# EAGLE design rev1_6 (EAGLE 7.6.0)
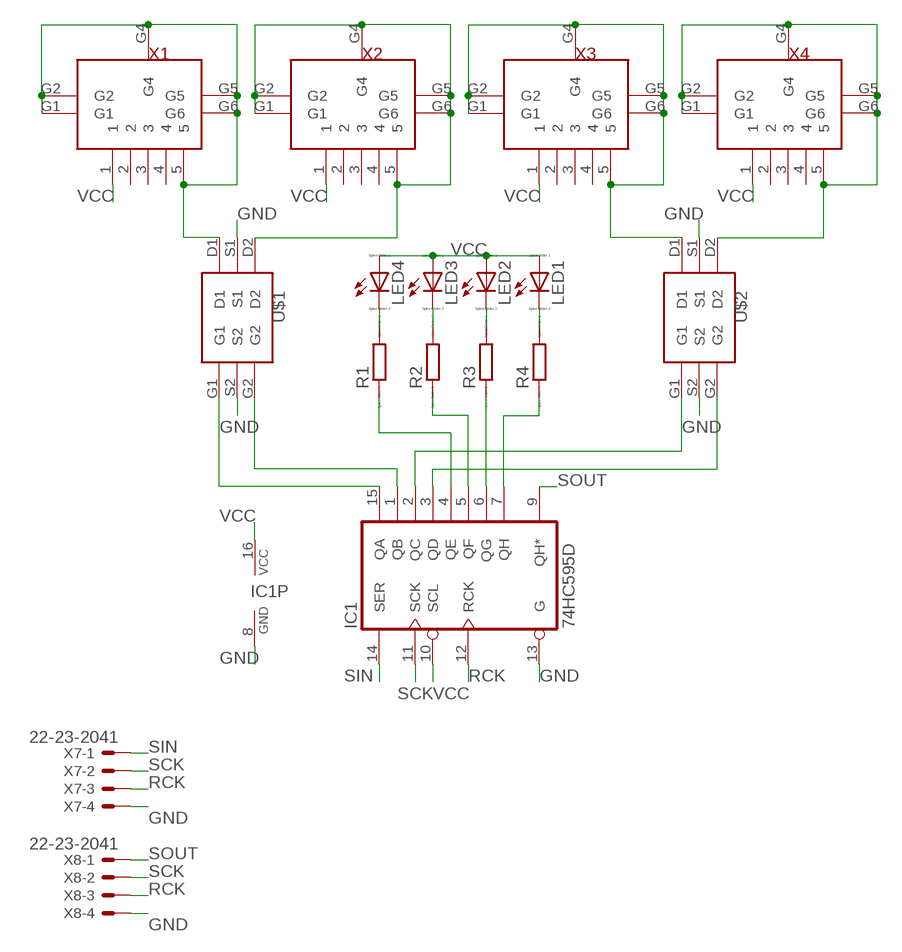
[diagram p0: schematic, sheet 1]

## Parts
IC1  74HC595D  [SO16]
LED1  LED_E  [LED_1206]
LED2  LED_E  [LED_1206]
LED3  LED_E  [LED_1206]
LED4  LED_E  [LED_1206]
R1  RR1005  [R1005]
R2  RR1005  [R1005]
R3  RR1005  [R1005]
R4  RR1005  [R1005]
U$1  FDC6305N  [FDC6305]
U$2  FDC6305N  [FDC6305]
X1  MUSBV  [MUSBV]
X2  MUSBV  [MUSBV]
X3  MUSBV  [MUSBV]
X4  MUSBV  [MUSBV]
X7  22-23-2041  [22-23-2041]
X8  22-23-2041  [22-23-2041]

## Nets
GND: IC1.8(GND) IC1.13(G) U$1.S1 U$1.S2 U$2.S1 U$2.S2 X7.4 X8.4
N$1: IC1.15(QA) U$1.G1
N$2: IC1.1(QB) U$1.G2
N$3: IC1.2(QC) U$2.G1
N$4: IC1.3(QD) U$2.G2
N$5: LED4.C R1.2
N$6: LED3.C R2.2
N$7: LED2.C R3.2
N$8: LED1.C R4.2
N$9: U$1.D1 X1.5 X1.G1 X1.G2 X1.G4 X1.G5 X1.G6
N$10: U$1.D2 X2.5 X2.G1 X2.G2 X2.G4 X2.G5 X2.G6
N$11: U$2.D1 X3.5 X3.G1 X3.G2 X3.G4 X3.G5 X3.G6
N$12: U$2.D2 X4.5 X4.G1 X4.G2 X4.G4 X4.G5 X4.G6
N$13: IC1.4(QE) R1.1
N$14: IC1.5(QF) R2.1
N$15: IC1.6(QG) R3.1
N$16: IC1.7(QH) R4.1
RCK: IC1.12(RCK) X7.3 X8.3
SCK: IC1.11(SCK) X7.2 X8.2
SIN: IC1.14(SER) X7.1
SOUT: IC1.9(QH*) X8.1
VCC: IC1.10(SCL) IC1.16(VCC) LED1.A LED2.A LED3.A LED4.A X1.1 X2.1 X3.1 X4.1
Unconnected: X1.2 X1.3 X1.4 X2.2 X2.3 X2.4 X3.2 X3.3 X3.4 X4.2 X4.3 X4.4

## Library data of the parts
IC1 = 74xx-eu:74*595: 8-bit SHIFT REGISTER, output latch
LED1-LED4 = eagle-ltspice:LED_E: LED Source: http://www.osram.convergy.de Source: www.luxeon.com Source: www.kingbright.com; SPICEMODEL: NONE; SPICEPREFIX: D; SPICETYPE: diode
R1-R4 = eagle-ltspice:R: RESISTOR, European symbol; SPICEMODEL: NONE; SPICEPREFIX: R
U$1 U$2 = FDC6305N:FDC6305N
X1-X4 = MUSBV:MUSBV
X7 X8 = con-molex:22-23-2041: .100" (2.54mm) Center Header - 4 Pin; MF: MOLEX; MPN: 22-23-2041; OC_FARNELL: 1462920; OC_NEWARK: 38C0355

## Board
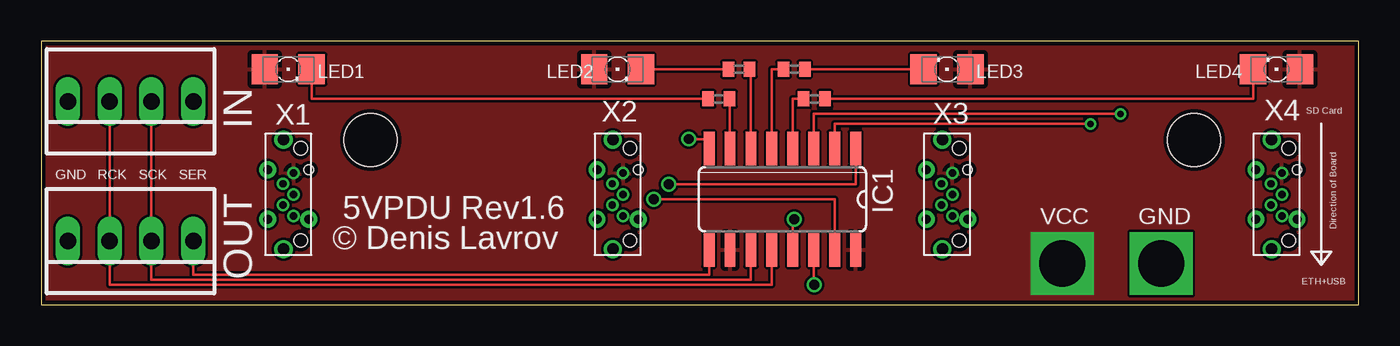
[diagram p1: board, top side]
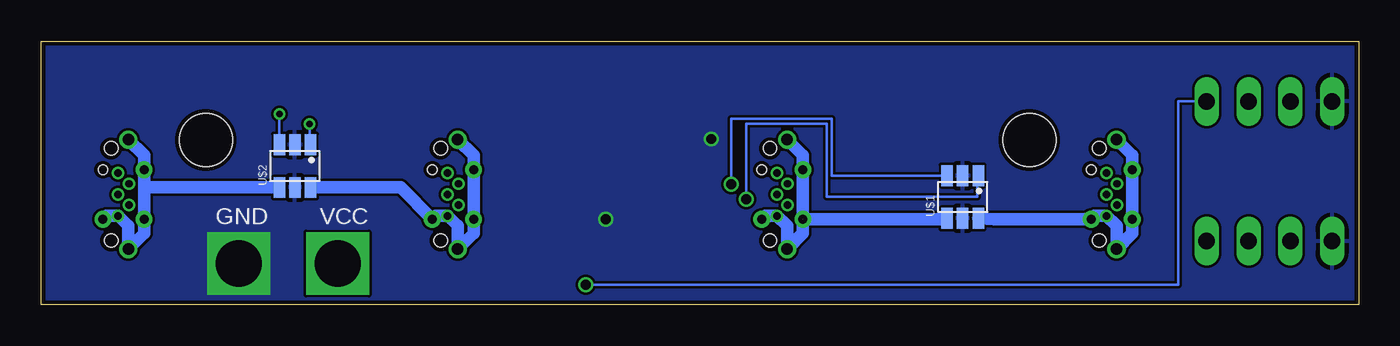
[diagram p2: board, bottom side, seen from below]

Size 80 x 16 mm. Coordinates in mm from the lower left corner, seen from the top.
Outline: 0,0 80,0 80,16 0,16 0,0
Copper layers (1*16): Top 0.035mm / dielectric 1.5mm / Bottom 0.035mm
Design rules "SeeedStudio_2layer_DRU_no_angle_20140221 *": minimum track width 6mil, minimum drill 12mil, track to track 6mil, track to pad 6mil, pad to pad 6mil, via to via 6mil, smd to smd 0mil, copper to edge 10mil, drill to drill 10mil, minimum pad ring 6mil, minimum via ring 6mil, stop-mask expansion 2mil, vias tented up to drill 100mil, thermal gap 10mil
Holes 3.2 mm at 20,10 70,10

### Footprints (pad centres in the part's own frame; a part is rotated, then mirrored left to right if it is on the bottom)
SO16 = smd 0.66 x 2.032: 1 -4.445,-3.073; 2 -3.175,-3.073; 3 -1.905,-3.073; 4 -0.635,-3.073; 5 0.635,-3.073; 6 1.905,-3.073; 7 3.175,-3.073; 8 4.445,-3.073; 9 4.445,3.073; 10 3.175,3.073; 11 1.905,3.073; 12 0.635,3.073; 13 -0.635,3.073; 14 -1.905,3.073; 15 -3.175,3.073; 16 -4.445,3.073
LED_1206 = smd 1.6 x 1.803: A -1.422,0; C 1.422,0
R1005 = smd 0.7 x 0.9: 1 -0.65,0; 2 0.65,0
FDC6305 = smd 1.27 x 0.7: D1 -0.4,0.55; D2 -0.4,2.45; G1 2.2,0.55; G2 2.2,2.45; S1 -0.4,1.5; S2 2.2,1.5
MUSBV = drill 0.45 pad 0.7: 1 -1.3,0.325; 2 -0.65,-0.325; 3 0,0.325; 4 0.65,-0.325; 5 1.3,0.325 | drill 0.55 pad 1.016: G1 -1.5,-1.25; G4 1.5,1.25; G6 1.5,-1.25 | drill 0.7 pad 1.1: G2 -3.325,-0.29; G5 3.325,-0.29 | hole 0.8: 2.8,0.75; -2.8,0.75 | hole 0.55: -1.5,1.25
22-23-2041 = drill 1 long: 1 -3.81,0; 2 -1.27,0; 3 1.27,0; 4 3.81,0

### Placement (x,y rotation side)
IC1  45,6.4 180 top
LED1  15,14.3 0 top
LED2  35,14.3 0 top
LED3  55,14.3 180 top
LED4  75,14.3 180 top
R1  46.94,12.5 0 top
R2  45.72,14.3 0 top
R3  42.37,14.3 180 top
R4  41.15,12.5 180 top
U$1  22.56,5.64 90 bottom
U$2  63.09,7.52 90 bottom
X1  15,6.7 270 top
X2  35,6.7 270 top
X3  55,6.7 270 top
X4  75,6.7 270 top
X7  5.43,12.34 180 top
X8  5.43,3.86 180 top

### Tracks (layer width: path | path; a pad name or v marks a point on that pad's centre or on a via)
GND  (via drill 0.6, 2.8)
  Top 0.152: IC1.13 45.63,5.18 v45.72,5.18 | IC1.8 40.55,10.06 v39.32,10.06
  other vias: 68,2.5
  pour Bottom: 0,15.85 0,0 79.86,0 79.86,15.85
N$1  (via drill 0.6)
  Top 0.152: IC1.15 48.17,6.4 v37.19,6.4
  Bottom 0.152: v37.19,6.4 37.19,10.97 32.31,10.97 32.31,6.55 23.16,6.55 23.16,7.53 U$1.G1
N$2  (via drill 0.6)
  Top 0.152: IC1.1 49.45,7.32 v38.1,7.32
  Bottom 0.152: v38.1,7.32 38.1,11.28 32,11.28 32,7.84 U$1.G2
N$3  (via drill 0.4)
  Top 0.152: IC1.2 48.17,10.97 v63.7,10.97
  Bottom 0.152: v63.7,10.97 63.7,9.72 U$2.G1
N$4  (via drill 0.4)
  Top 0.152: IC1.3 46.91,11.58 v65.53,11.58
  Bottom 0.152: v65.53,11.58 U$2.G2
N$5
  Top 0.152: R1.2 73.58,12.5 LED4.C
N$6
  Top 0.152: R2.2 LED3.C
N$7
  Top 0.152: R3.2 LED2.C
N$8
  Top 0.152: R4.2 16.42,12.5 LED1.C
N$9
  Bottom 0.762: X1.G2 13.75,9.06 X1.G1 X1.G6 13.75,4.33 X1.G5 14.71,4.78 X1.5 16.05,5.39 X1.G4 22.15,5.2 U$1.D1
N$10  (1 unrouted)
  Bottom 0.762: X2.G4 36.05,5.39 X2.5 34.71,4.78 X2.G5 33.75,4.33 33.75,5.18 | 33.75,5.18 X2.G1 33.75,9.06 X2.G2 | U$1.D2 25.37,5.18 33.75,5.18
N$11
  Bottom 0.762: X3.G2 53.75,9.06 X3.G1 X3.G6 53.75,4.33 X3.G5 54.71,4.78 X3.5 56.05,5.39 X3.G4 58.17,7.12 U$2.D1
N$12
  Bottom 0.762: 73.75,7.01 X4.G6 73.75,4.33 X4.G5 74.71,4.78 X4.5 76.05,5.39 X4.G4 | 73.75,7.01 X4.G1 73.75,9.06 X4.G2 | U$2.D2 73.64,7.12 73.75,7.01
N$13
  Top 0.152: R1.1 45.63,12.5 IC1.4
N$14
  Top 0.152: R2.1 44.37,14.29 IC1.5
N$15
  Top 0.152: R3.1 43.09,14.2 IC1.6
N$16
  Top 0.152: R4.1 41.8,9.78 IC1.7
RCK
  Top 0.152: IC1.12 44.37,1.22 4.16,1.22 X8.3 X7.3
SCK
  Top 0.152: IC1.11 43.09,1.52 6.7,1.52 X8.2 X7.2
SIN  (via drill 0.6)
  Top 0.152: v46.94,1.22 46.91,1.22 IC1.14
  Bottom 0.152: v46.94,1.22 10.97,1.22 10.97,12.34 X7.1
SOUT
  Top 0.152: IC1.9 40.55,1.83 9.23,1.83 X8.1
VCC  (via drill 2.8)
  other vias: 62,2.5
  pour Top: 0,15.85 0,0 79.86,0 79.86,15.85

### Text on the board
tPlace: SD Card | IN | GND | RCK | SCK | SER | 5VPDU Rev1.6 | VCC | GND | Direction of Board | © Denis Lavrov | OUT | ETH+USB
bPlace: VCC | GND